# EasyEDA Pro project RealisticPM_2026-10-08.epro, board PM2_5_small
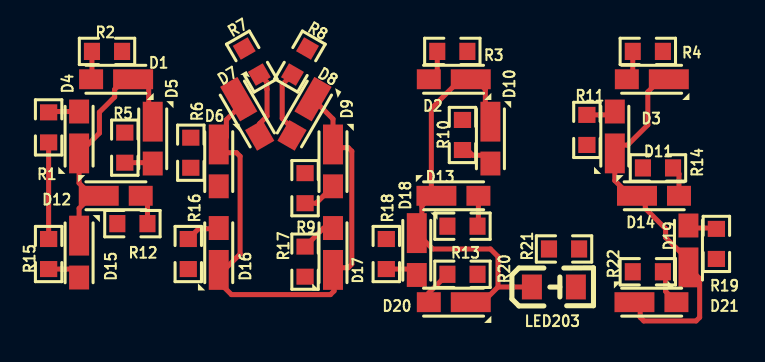
[diagram p6: board, top side]
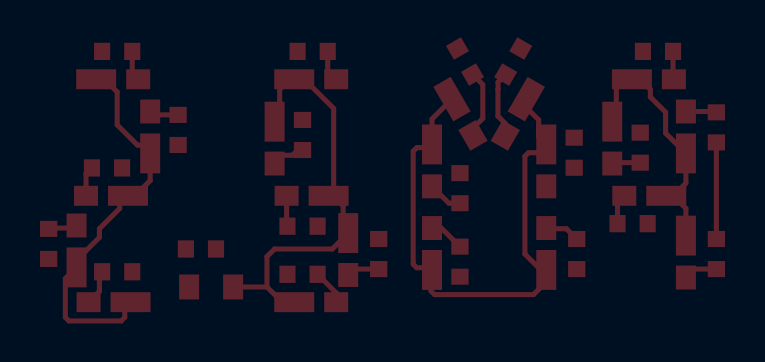
[diagram p7: board, bottom side, seen from below]

No outline. copper layers: Top Layer, Bottom Layer. Coordinates in mm from the lowest, leftmost part position.
Stack: Top Layer 0.035mm / Dielectric1 1.51mm FR4 er 4.5 / Bottom Layer 0.035mm

## Design rules (mm)
spacing copperThickness1oz (default): track to track 0.102, other pairs 0.152 to 0.3
spacing copperThickness2oz: track to track 0.203, other pairs 0.152 to 0.3
spacing Plane_innerPlane: track to track 0.102, other pairs 0.152 to 0.3
spacing Copper_copperRegion: track to track 0.102, other pairs 0.152 to 0.3
track width copperThickness1oz (default): min 0.127, default 0.254, max 2.54
track width copperThickness2oz: min 0.203, default 0.254, max 2.54
differential pair differentialPair (default): width min 0.127, default 0.254, max 2.54; gap min 0.152, default 0.152

## Placement (name value [footprint] x y rotation side)
D1  GW JCLPS2.CM-GVH3-A131-1-65-2-R33  [LED-SMD_L3.0-W1.4-RD]  3.17 11.18 180 top
D2  GW JCLPS2.CM-GVH3-A131-1-65-2-R33  [LED-SMD_L3.0-W1.4-RD]  20.07 11.18 180 top
D3  GW JCLPS2.CM-GVH3-A131-1-65-2-R33  [LED-SMD_L3.0-W1.4-RD]  29.97 11.18 180 top
D4  GW JCLPS2.CM-GVH3-A131-1-65-2-R33  [LED-SMD_L3.0-W1.4-RD]  1.52 8.51 90 top
D5  GW JCLPS2.CM-GVH3-A131-1-65-2-R33  [LED-SMD_L3.0-W1.4-RD]  5.21 8 270 top
D6  GW JCLPS2.CM-GVH3-A131-1-65-2-R33  [LED-SMD_L3.0-W1.4-RD]  8.51 6.86 270 top
D7  GW JCLPS2.CM-GVH3-A131-1-65-2-R33  [LED-SMD_L3.0-W1.4-RD]  10.03 9.27 300 top
D8  GW JCLPS2.CM-GVH3-A131-1-65-2-R33  [LED-SMD_L3.0-W1.4-RD]  12.7 9.27 240 top
D9  GW JCLPS2.CM-GVH3-A131-1-65-2-R33  [LED-SMD_L3.0-W1.4-RD]  14.22 6.86 270 top
D10  GW JCLPS2.CM-GVH3-A131-1-65-2-R33  [LED-SMD_L3.0-W1.4-RD]  22.1 8 270 top
D11  GW JCLPS2.CM-GVH3-A131-1-65-2-R33  [LED-SMD_L3.0-W1.4-RD]  28.32 8.51 90 top
D12  GW JCLPS2.CM-GVH3-A131-1-65-2-R33  [LED-SMD_L3.0-W1.4-RD]  3.56 5.33 0 top
D13  GW JCLPS2.CM-GVH3-A131-1-65-2-R33  [LED-SMD_L3.0-W1.4-RD]  20.45 5.33 0 top
D14  GW JCLPS2.CM-GVH3-A131-1-65-2-R33  [LED-SMD_L3.0-W1.4-RD]  30.48 5.33 0 top
D15  GW JCLPS2.CM-GVH3-A131-1-65-2-R33  [LED-SMD_L3.0-W1.4-RD]  1.52 2.29 270 top
D16  GW JCLPS2.CM-GVH3-A131-1-65-2-R33  [LED-SMD_L3.0-W1.4-RD]  8.51 2.67 90 top
D17  GW JCLPS2.CM-GVH3-A131-1-65-2-R33  [LED-SMD_L3.0-W1.4-RD]  14.22 2.67 90 top
D18  GW JCLPS2.CM-GVH3-A131-1-65-2-R33  [LED-SMD_L3.0-W1.4-RD]  18.41 2.41 270 top
D19  GW JCLPS2.CM-GVH3-A131-1-65-2-R33  [LED-SMD_L3.0-W1.4-RD]  32 2.79 90 top
D20  GW JCLPS2.CM-GVH3-A131-1-65-2-R33  [LED-SMD_L3.0-W1.4-RD]  20.07 0 180 top
D21  GW JCLPS2.CM-GVH3-A131-1-65-2-R33  [LED-SMD_L3.0-W1.4-RD]  30.35 0 0 top
LED203  LSM0805543V  [LED0805-RD_WHITE]  25.27 0.76 0 top
R1  330Ω  [R0603]  0 8.76 90 top
R2  330Ω  [R0603]  2.92 12.57 180 top
R3  330Ω  [R0603]  20.19 12.57 180 top
R4  330Ω  [R0603]  29.97 12.57 180 top
R5  330Ω  [R0603]  3.81 7.75 90 top
R6  330Ω  [R0603]  7.11 7.49 270 top
R7  330Ω  [R0603]  10.16 12.06 120 top
R8  330Ω  [R0603]  12.57 12.06 60 top
R9  330Ω  [R0603]  12.83 5.72 270 top
R10  330Ω  [R0603]  20.7 8.38 90 top
R11  330Ω  [R0603]  26.92 8.64 270 top
R12  330Ω  [R0603]  4.19 3.94 0 top
R13  330Ω  [R0603]  20.7 3.81 0 top
R14  330Ω  [R0603]  30.48 6.73 0 top
R15  330Ω  [R0603]  0 2.41 270 top
R16  330Ω  [R0603]  6.98 2.41 90 top
R17  330Ω  [R0603]  12.83 2.03 90 top
R18  330Ω  [R0603]  16.89 2.41 270 top
R19  330Ω  [R0603]  33.4 2.92 90 top
R20  330Ω  [R0603]  20.7 1.4 180 top
R21  330Ω  [R0603]  25.78 2.67 0 top
R22  330Ω  [R0603]  29.97 1.52 0 top

## Footprints (pads in the part's own frame, mm; a bottom-side part is the same pattern mirrored in y, then rotated)
LED0805-RD_WHITE
  rect 1x1.25 smd: 1(-1.1,0) 2(1.1,0)
LED-SMD_L3.0-W1.4-RD
  rect 2x1 smd: 1(-1.05,0)
  rect 1.2x1 smd: 2(1.05,0)
R0603
  rect 0.806x0.864 smd: 1(-0.753,0) 2(0.753,0)

## Nets
As in the schematic, except:
REG: D1.1 D2.1 D3.1 D4.1 D5.1 D6.1 D7.1 D8.1 D9.1 D10.1 D11.1 D12.1 D13.1 D14.1 D15.1 D16.1 D17.1 D18.1 D19.1 D20.1 D21.1 LED203.1
$1N2040: LED203.2 R21.2

## Routing (per net, layer and track width the routed paths; a pad name or vN(x,y) marks a point on that pad's centre or on a via; arc(x,y) is an arc through that point)
VCC: length 4.8
  Top Layer w0.254: R1.1 R15.1
REG: length 82.4
  Top Layer w0.254: D10.1 21.84,9.31 21.84,10.67 21.34,11.18 D2.1 20.61,11.18 19.14,9.71 19.14,5.59 D13.1 19.18,5.33 18.67,4.83 18.67,3.72 D18.1 19.21,2.67 22.1,2.67 22.48,2.29 22.48,0.76 ; D5.1 5.01,9.25 5.01,10.86 4.54,10.86 D1.1 3.81,11.18 3.3,10.67 3.3,10.29 2.54,9.53 2.54,8.47 D4.1 1.52,5.97 2.16,5.33 ; 2.16,5.33 D12.1 ; 2.16,5.33 1.52,4.7 D15.1 ; D21.1 29.59,-0.29 29.59,-0.76 29.77,-0.94 32.38,-0.94 32.56,-0.76 32.56,1.18 D19.1 32,2.1 30.86,3.25 30.86,3.68 29.84,4.7 29.84,4.92 D14.1 29.08,5.33 28.32,6.1 D11.1 28.74,7.87 28.96,7.87 29.97,8.89 29.97,10.54 30.61,11.18 31.02,11.18 ; 22.48,0.76 21.72,0 D20.1 ; 22.48,0.76 LED203.1 ; D8.1 14.22,9.18 D9.1 14.38,7.75 14.99,7.75 15.17,7.57 15.17,1.91 14.99,1.73 14.33,1.73 D17.1 14.22,1.49 14.28,1.44 14.28,0.56 14.1,0.38 9.14,0.38 8.51,1.02 D16.1 8.78,1.62 9.58,2.41 9.58,7.31 9.4,7.49 8.92,7.49 D6.1 8.89,8.29 8.89,9.14 9.51,9.76 D7.1
$1N510: length 1.5
  Top Layer w0.254: D12.2 4.94,5 R12.2
$1N514: length 1.5
  Top Layer w0.254: R1.2 0.04,9.56 D4.2
$1N518: length 1.7
  Top Layer w0.254: D15.2 1.1,1.66 R15.2
$1N521: length 1.4
  Top Layer w0.254: D1.2 2.17,11.22 R2.2
$1N522: length 1.4
  Top Layer w0.254: D5.2 5.16,6.99 R5.1
$1N974: length 3.4
  Top Layer w0.254: D7.2 10.56,8.96 10.93,9.32 10.93,10.66 10.92,10.67 10.92,11.03 R7.1
$1N981: length 1.8
  Top Layer w0.254: R16.2 7.5,3.68 8.47,3.68 D16.2
$1N1114: length 3.5
  Top Layer w0.254: D8.2 12.17,8.72 11.68,9.21 11.68,10.91 12.18,11.41 R8.1
$1N1215: length 1.7
  Top Layer w0.254: R9.2 13.38,4.96 D9.2
$1N1326: length 1.8
  Top Layer w0.254: D17.2 13.76,3.72 R17.2
$1N1705: length 1.7
  Top Layer w0.254: R10.1 20.95,7.63 21.21,7.37 21.68,7.37 D10.2
$1N1707: length 1.6
  Top Layer w0.254: D2.2 19.44,11.6 R3.2
$1N1710: length 1.5
  Top Layer w0.254: D13.2 21.5,3.85 R13.2
$1N1813: length 1.6
  Top Layer w0.254: R18.2 18.12,1.66 D18.2
$1N1896: length 1.8
  Top Layer w0.254: D20.2 19.02,0.47 R20.2
$1N2547: length 1.5
  Top Layer w0.254: R4.2 29.22,11.47 D3.2
$1N2548: length 1.5
  Top Layer w0.254: R14.2 31.53,6.43 D14.2
$1N2550: length 1.5
  Top Layer w0.254: R11.1 28.15,9.39 D11.2
$1N2558: length 1.4
  Top Layer w0.254: R19.2 33.36,3.72 32,3.72
$1N2559: length 1.8
  Top Layer w0.254: D21.2 30.86,0.54 30.86,1.39 R22.2
